# EAGLE schematic dimmerWall (EAGLE 7.5.0)
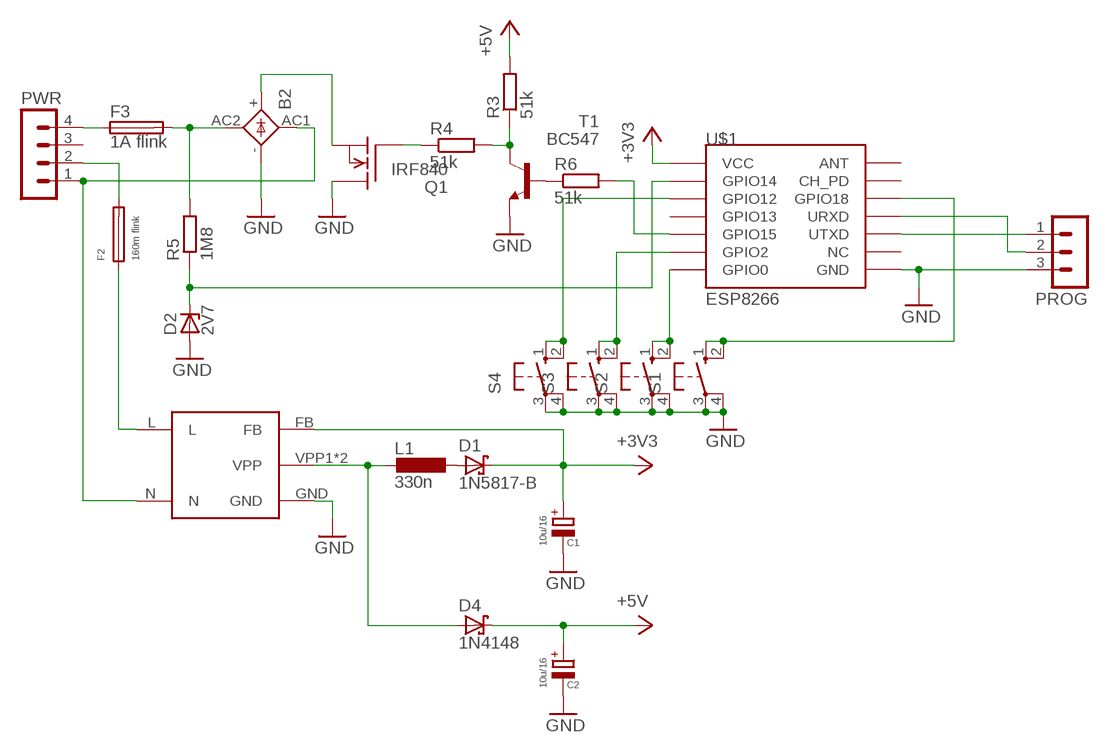
[diagram p0: schematic, sheet 1]

## Parts
B2  2KBP  [2KBP]
C1  10u/16  CPOL-EUTT2D4L  [TT2D4L]
C2  10u/16  CPOL-EUTT2D4L  [TT2D4L]
D1  1N5817-B  [DO41-7.6]
D2  2V7  ZENER-DIODEDO34-7  [DO34Z7]
D4  1N4148  1N5817-B  [DO41-7.6]
F2  160m flink  19560  [19560]
F3  1A flink  FUSESHK20L  [SHK20L]
L1  330n  L-EU0204/5  [0204/5]
PROG  MA03-1  [MA03-1]
PWR  MA04-1  [MA04-1]
Q1  IRF840  [TO220]
R3  51k  R-EU_0207/12  [0207/12]
R4  51k  R-EU_0207/12  [0207/12]
R5  1M8  R-EU_0207/12  [0207/12]
R6  51k  R-EU_0207/12  [0207/12]
S1  10-XX  [B3F-10XX]
S2  10-XX  [B3F-10XX]
S3  10-XX  [B3F-10XX]
S4  10-XX  [B3F-10XX]
T1  BC547  [TO92]
U$1  ESP8266  [ESP-03]
U$2  SMPS  [SMPS]

## Nets
+3V3: C1.+ D1.C U$1.VCC U$2.FB
+5V: C2.+ D4.C R3.2
GND: B2.- C1.- C2.- D2.A PROG.3 Q1.2(D) S1.3(P) S1.4(P1) S2.3(P) S2.4(P1) S3.3(P) S3.4(P1) S4.3(P) S4.4(P1) T1.1(E) U$1.GND U$2.GND
N$1: Q1.1(G) R4.1
N$2: R3.1 R4.2 T1.3(C)
N$3: D1.A L1.1
N$4: B2.AC1 PWR.1 U$2.N
N$5: R6.1 T1.2(B)
N$6: D4.A L1.2 U$2.VPP1(VPP) U$2.VPP2(VPP)
N$7: D2.C R5.1 U$1.GPIO14
N$8: F2.2 PWR.2
N$9: F2.1 U$2.L
N$10: R6.2 U$1.GPIO15
N$11: PROG.1 U$1.UTXD
N$12: PROG.2 U$1.URXD
N$13: S2.1(S) S2.2(S1) U$1.GPIO0
N$14: S3.1(S) S3.2(S1) U$1.GPIO2
N$15: S1.1(S) S1.2(S1) U$1.GPIO18
N$16: S4.1(S) S4.2(S1) U$1.GPIO12
N$17: B2.AC2 F3.2A R5.2
N$21: B2.+ Q1.3(S)
N$31: F3.1A PWR.4
Unconnected: PWR.3 U$1.ANT U$1.CH_PD U$1.GPIO13 U$1.NC

## Library data of the parts
B2 = rectifier:2KBP: RECTIFIER grid 3 x 3,81 mm
C1 C2 = rcl:CPOL-EU: POLARIZED CAPACITOR, European symbol
D1 D4 = diode:1N581*: 1.0A SCHOTTKY BARRIER RECTIFIER Source: http://www.diodes.com/datasheets/ds23001.pdf
D2 = diode:ZENER-DIODE: Z-Diode
F2 = fuse:19560: FUSE HOLDER TR5, Wickmann; MPN: 56000001009; OC_FARNELL: 1185363; OC_NEWARK: 15P8392
F3 = fuse:FUSE: Fuse; OC_FARNELL: unknown; OC_NEWARK: unknown
L1 = rcl:L-EU: INDUCTOR, European symbol
PROG = con-lstb:MA03-1: PIN HEADER; OC_FARNELL: unknown; OC_NEWARK: unknown
PWR = con-lstb:MA04-1: PIN HEADER; OC_FARNELL: unknown; OC_NEWARK: unknown
Q1 = transistor-fet:IRF840: N-Channel Enhancement MOSFET (HEXFET); 500V; 8A; 0,85Ohm
R3-R6 = rcl:R-EU_: RESISTOR, European symbol
S1-S4 = switch-omron:10-XX: OMRON SWITCH; MPN: B3F-1000; OC_FARNELL: 176432; OC_NEWARK: 36M3542
T1 = transistor:BC547: NPN TRANSISTOR
U$1 = esp8266modules:ESP8266: ESP8266 Wifi module 03 & 04
U$2 = smps:SMPS